# Altium schematic sheet CPU.SchDoc
size 292 x 203 mm
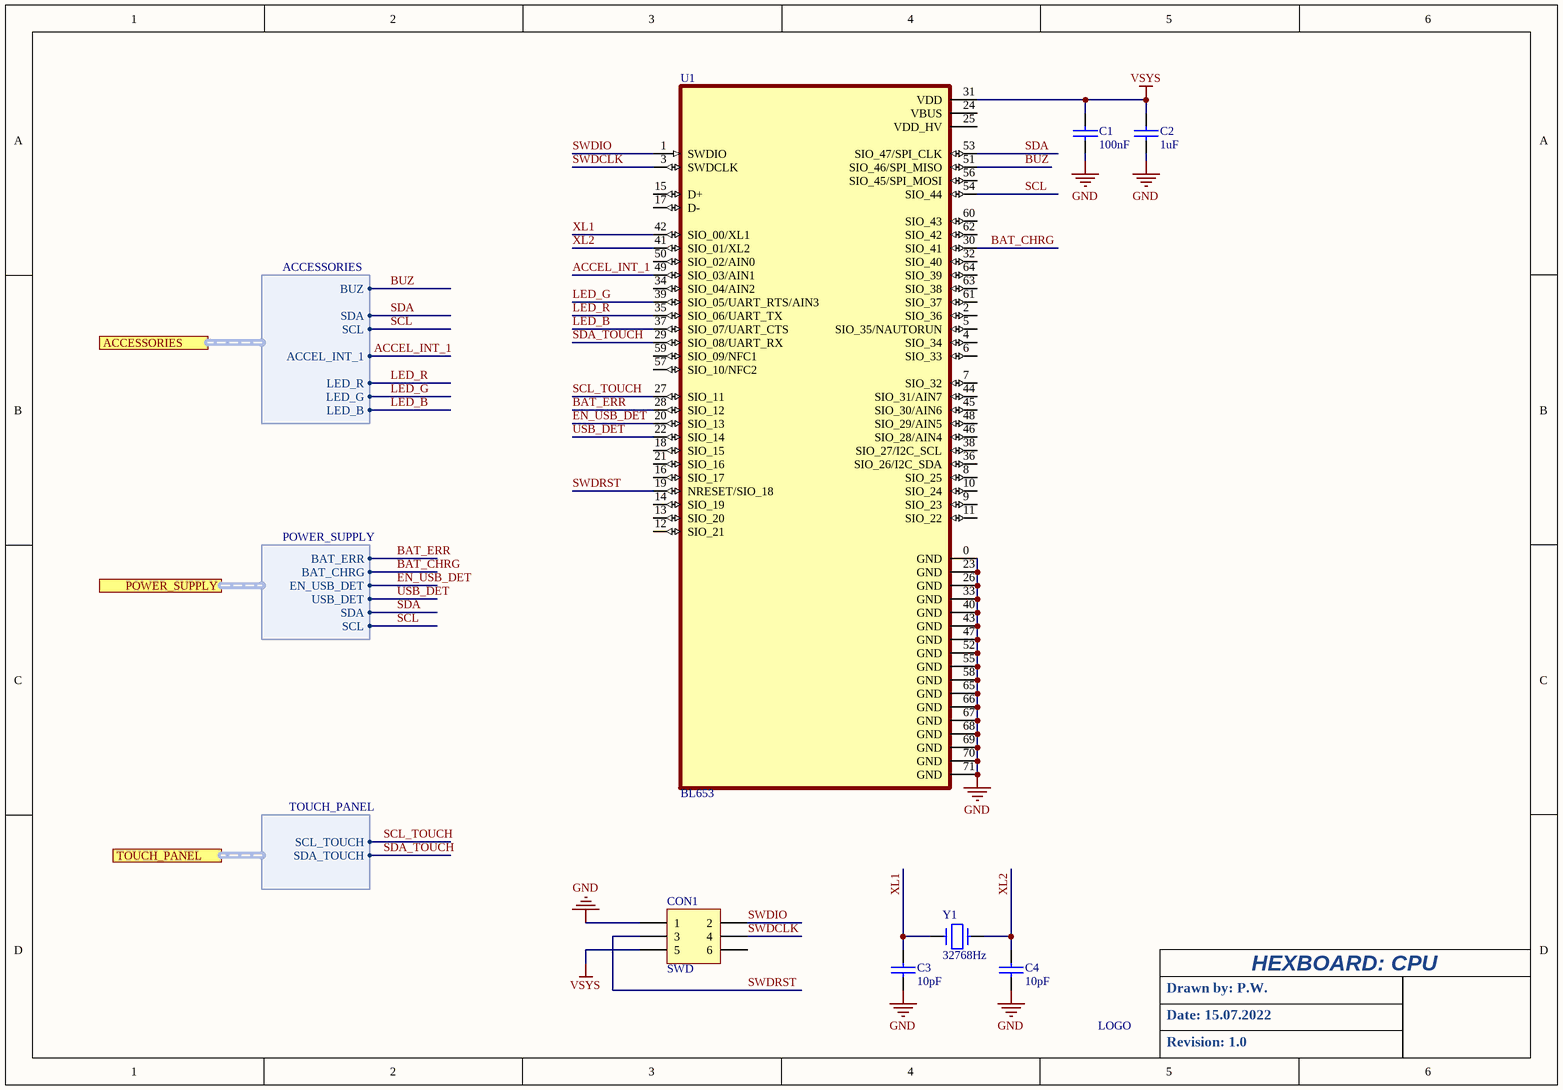
[diagram p0: CPU.SchDoc]

## Parts
*1  LOGO  [NEWLOGO2]  (value not drawn)
C1  100nF  [C0603L]
C2  1uF  [C0603L]
C3  10pF  [C0603L]
C4  10pF  [C0603L]
CON1  SWD  [HDR2x3_1mm27]
U1  BL653  [BL653]
Y1  32768Hz  [X_FC-13F]

## Ports
ACCESSORIES (harness ACCESSORIES), POWER_SUPPLY (harness POWER_SUPPLY), TOUCH_PANEL (harness TOUCH_PANEL)

## Harnesses
ACCESSORIES: ACCEL_INT_1, LED_R, LED_G, SDA, SCL, LED_B, BUZ
POWER_SUPPLY: BAT_ERR, BAT_CHRG, EN_USB_DET, SDA, SCL, USB_DET
TOUCH_PANEL: SDA_TOUCH, SCL_TOUCH

## Nets
GND: C1.2 C2.2 C3.2 C4.2 CON1.1 U1.0(GND) U1.23(GND) U1.26(GND) U1.33(GND) U1.40(GND) U1.43(GND) U1.47(GND) U1.52(GND) U1.55(GND) U1.58(GND) U1.65(GND) U1.66(GND) U1.67(GND) U1.68(GND) U1.69(GND) U1.70(GND) U1.71(GND)
VSYS: C1.1 C2.1 CON1.5 U1.31(VDD)
ACCEL_INT_1: U1.49(SIO_03/AIN1) ; port ACCESSORIES.ACCEL_INT_1
BAT_CHRG: U1.30(SIO_41) ; port POWER_SUPPLY.BAT_CHRG
BAT_ERR: U1.28(SIO_12) ; port POWER_SUPPLY.BAT_ERR
BUZ: U1.51(SIO_46/SPI_MISO) ; port ACCESSORIES.BUZ
EN_USB_DET: U1.20(SIO_13) ; port POWER_SUPPLY.EN_USB_DET
LED_B: U1.37(SIO_07/UART_CTS) ; port ACCESSORIES.LED_B
LED_G: U1.39(SIO_05/UART_RTS/AIN3) ; port ACCESSORIES.LED_G
LED_R: U1.35(SIO_06/UART_TX) ; port ACCESSORIES.LED_R
SCL: U1.54(SIO_44) ; port ACCESSORIES.SCL, port POWER_SUPPLY.SCL
SCL_TOUCH: U1.27(SIO_11) ; port TOUCH_PANEL.SCL_TOUCH
SDA: U1.53(SIO_47/SPI_CLK) ; port ACCESSORIES.SDA, port POWER_SUPPLY.SDA
SDA_TOUCH: U1.29(SIO_08/UART_RX) ; port TOUCH_PANEL.SDA_TOUCH
SWDCLK: CON1.4 U1.3(SWDCLK)
SWDIO: CON1.2 U1.1(SWDIO)
SWDRST: CON1.3 U1.19(NRESET/SIO_18)
USB_DET: U1.22(SIO_14) ; port POWER_SUPPLY.USB_DET
XL1: C3.1 U1.42(SIO_00/XL1) Y1.1
XL2: C4.1 U1.41(SIO_01/XL2) Y1.2

Not connected (* = marked no-connect by the designer): CON1 6; U1 2(SIO_36) 4(SIO_34) 5(SIO_35/NAUTORUN) 6(SIO_33) 7(SIO_32) 8(SIO_25) 9(SIO_23) 10(SIO_24) 11(SIO_22) 12(SIO_21) 13(SIO_20) 14(SIO_19) 15(D+) 16(SIO_17) 17(D-) 18(SIO_15) 21(SIO_16) 24(VBUS) 25(VDD_HV) 32(SIO_40) 34(SIO_04/AIN2) 36(SIO_26/I2C_SDA) 38(SIO_27/I2C_SCL) 44(SIO_31/AIN7) 45(SIO_30/AIN6) 46(SIO_28/AIN4) 48(SIO_29/AIN5) 50(SIO_02/AIN0) 56(SIO_45/SPI_MOSI) 57(SIO_10/NFC2) 59(SIO_09/NFC1) 60(SIO_43) 61(SIO_37) 62(SIO_42) 63(SIO_38) 64(SIO_39)

## Notes on the sheet
- HEXBOARD: CPU
- Drawn by: P.W.
- Date: 15.07.2022
- Revision: 1.0

## Library data of the parts
C1-C4 = CAP: Capacitor
CON1 = Header 3X2: Header, 3-Pin, Dual row; LatestRevisionDate: 17-Jul-2002; LatestRevisionNote: Re-released for DXP Platform.; Publisher: Altium Limited
U1 = BL653: 802.15.4, Bluetooth Bluetooth v5.0, Thread Transceiver Module 2.4GHz Integrated, Trace Surface Mount; MP: 451-00001; MF: Laird -; Digi-Key_Part_Number: 451-00001CT-ND; Value: *; SnapEDA_Link: https://www.snapeda.com/parts/451-00001/Laird%20-%20Wireless%20%26%20Thermal%20Systems/view-part/2777643/?ref=snap; Package: Module Laird -; Digi-Key_Purchase_URL: https://www.digikey.com/product-detail/en/laird-wireless-thermal-systems/451-00001/451-00001CT-ND/9489361?utm_source=snapeda&utm_medium=aggregator&utm_campaign=symbol
Y1 = CRYSTAL